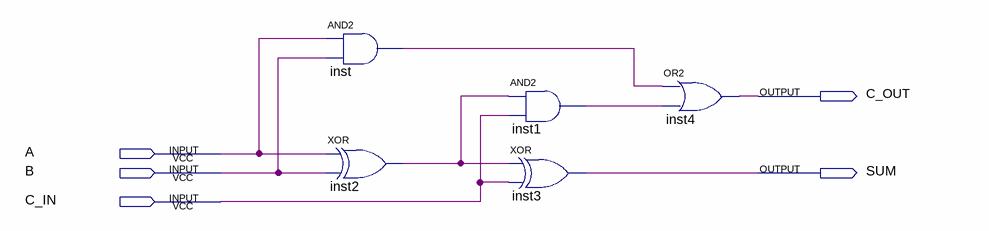
[diagram p0: schematic sheet]
// Quartus schematic One_Bit_adder.bdf as structural Verilog: 5 symbols, 5 pins
module One_Bit_adder (
  input  A,
  input  B,
  input  C_IN,
  output C_OUT,
  output SUM
);

  wire inst1_out, inst2_out, inst_out;

  and inst (inst_out, A, B);
  xor inst2 (inst2_out, A, B);
  and inst1 (inst1_out, inst2_out, C_IN);
  xor inst3 (SUM, inst2_out, C_IN);
  or inst4 (C_OUT, inst_out, inst1_out);
endmodule
